# Altium project G4y_SuperCap.PrjPcb
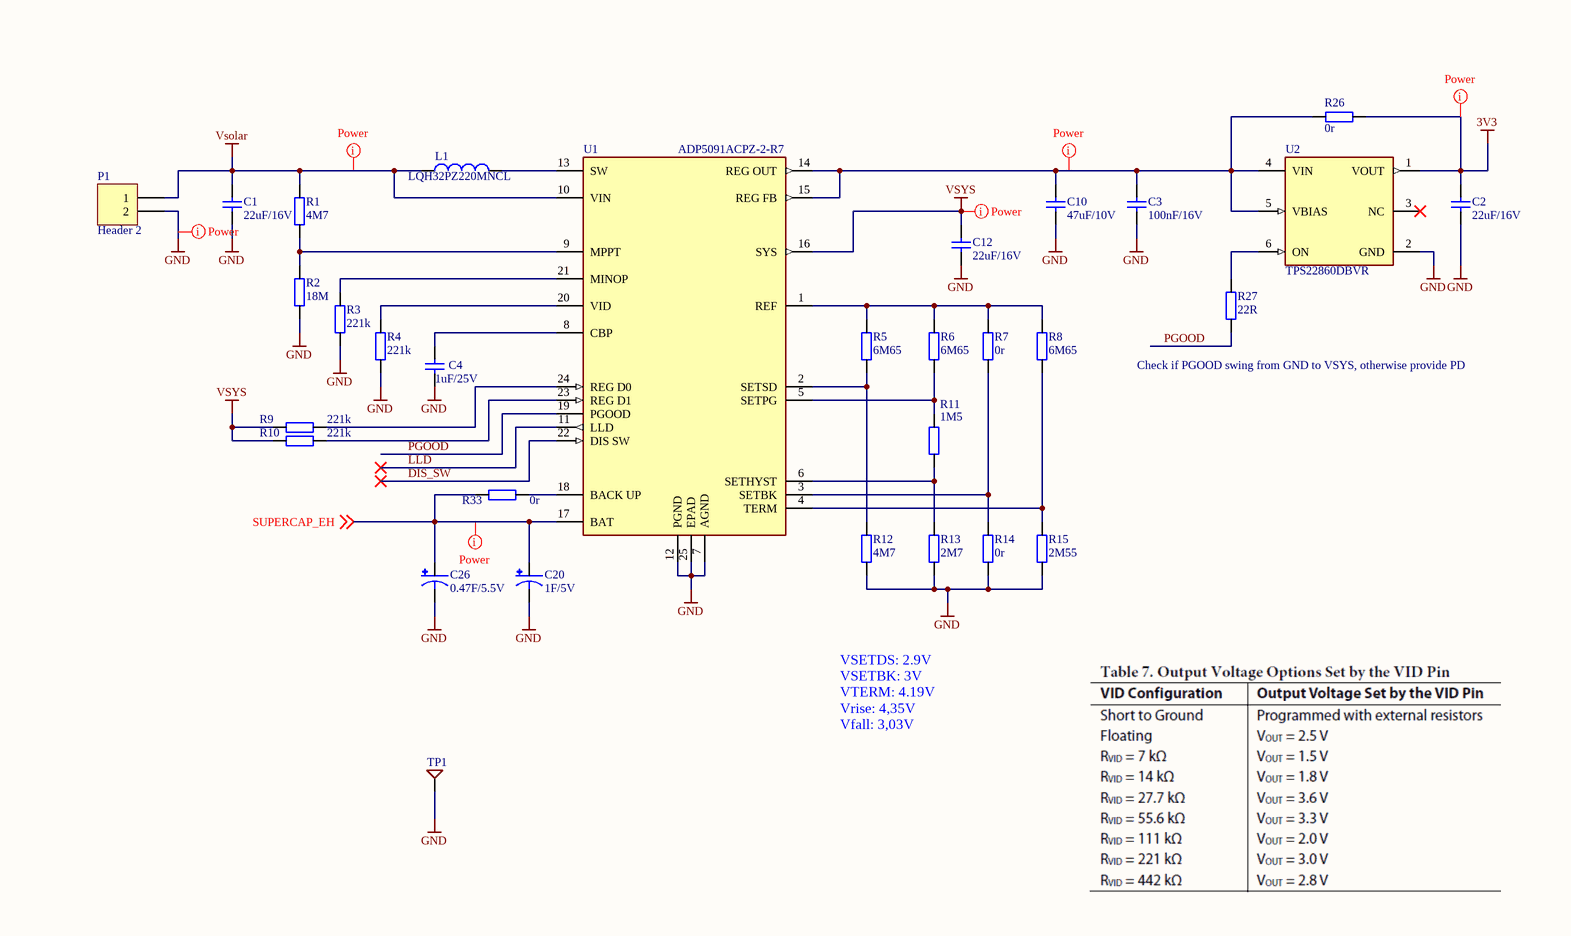
[diagram p0: PowerSupply.SchDoc, right]
3 sheets, 78 parts. Net scope: global (net labels, ports and power ports of the same name join across sheets).
Board file: G4y_SuperCap.PcbDoc
Sheets:
  PowerSupply.SchDoc
  Display.SchDoc
  G4y_SuperCap.SchDoc

## Sheet PowerSupply.SchDoc: PowerSupply
size A4; CheckedBy: D. Actis Grosso; Author: Simone C.; DocumentNumber: 2; Revision: 1.3; SheetNumber: 2; SheetTotal: 3

### Parts
C1  value 22uF/16V  [C0805]  (hidden comment: Cap_0805_22uF/16V)
C2  value 22uF/16V  [C0805]  (hidden comment: Cap_0805_22uF/16V)
C3  value 100nF/16V  [C0402]  (hidden comment: Cap_0402_100n/16V)
C4  value 1uF/25V  [C0402]  (hidden comment: Cap_0402_1uF/25V)
C10  value 47uF/10V  [C1206]  (hidden comment: Cap_1206_47uF/10V)
C12  value 22uF/16V  [C0805]  (hidden comment: Cap_0805_22uF/16V)
C20  value 1F/5V  [DGH105Q5R5]  (hidden comment: SuperCap_1F/5V)
C26  value 0.47F/5.5V  [SUPCAP_D20mm]  (hidden comment: SuperCap_0.47F/5.5V)
L1  Part Number: LQH32PZ220MNCL  [FP-LQH32PB_NC-MFG]  (hidden comment: Inductor_22uH_550mA)
P1  Header 2  [HDR1X2]  (no BOM)
R1  value 4M7  [R0402]  (hidden comment: R_R0402_4M7)
R2  value 18M  [R0402]  (hidden comment: R_R0402_18M)
R3  value 221k  [R0402]  (hidden comment: R_R0402_221k)
R4  value 221k  [R0402]  (hidden comment: R_R0402_221k)
R5  value 6M65  [R0402]  (hidden comment: R_R0402_6M65)
R6  value 6M65  [R0402]  (hidden comment: R_R0402_6M65)
R7  value 0r  [R0402]  (hidden comment: R_R0402_0R)
R8  value 6M65  [R0402]  (hidden comment: R_R0402_6M65)
R9  value 221k  [R0402]  (hidden comment: R_R0402_221k)
R10  value 221k  [R0402]  (hidden comment: R_R0402_221k)
R11  value 1M5  [R0402]  (hidden comment: R_R0402_1M5)
R12  value 4M7  [R0402]  (hidden comment: R_R0402_4M7)
R13  value 2M7  [R0402]  (hidden comment: R_R0402_2M7)
R14  value 0r  [R0402]  (hidden comment: R_R0402_0R)
R15  value 2M55  [R0402]  (hidden comment: R_R0402_2M55)
R26  value 0r  [R0402]  (hidden comment: R_R0402_0R)
R27  value 22R  [R0402]  (hidden comment: R_R0402_22R)
R33  value 0r  [R0402]  (hidden comment: R_R0402_0R)
TP1  TestPoint Trough Hole  [TestP-TH-1.32mm]  (value not drawn)  (no BOM)
U1  ADP5091ACPZ-2-R7  [FP-CP-24-14-IPC_B]
U2  TPS22860DBVR  [SOT-23-6]

### Nets
3V3: C2.1 R26.1 U2.1(VOUT)
GND: C1.2 C2.2 C3.2 C4.2 C10.2 C12.2 C20.- C26.- P1.2 R2.1 R3.1 R4.1 R12.1 R13.1 R14.1 R15.1 TP1.0(TP) U1.7(AGND) U1.12(PGND) U1.25(EPAD) U2.2(GND)
Vsolar: C1.1 L1.1 P1.1 R1.2 U1.10(VIN)
VSYS: C12.1 R9.2 R10.2 U1.16(SYS)
DIS_SW: U1.22(DIS_SW)
LLD: U1.11(LLD)
PGOOD: R27.2 U1.19(PGOOD)
SUPERCAP_EH: C20.+ C26.+ R33.2 U1.17(BAT) ; off-sheet SUPERCAP_EH
NetC3_1: C3.1 C10.1 R26.2 U1.14(REG_OUT) U1.15(REG_FB) U2.4(VIN) U2.5(VBIAS)
NetC4_1: C4.1 U1.8(CBP)
NetL1_2: L1.2 U1.13(SW)
NetR1_1: R1.1 R2.2 U1.9(MPPT)
NetR3_2: R3.2 U1.21(MINOP)
NetR4_2: R4.2 U1.20(VID)
NetR5_1: R5.1 R12.2 U1.2(SETSD)
NetR5_2: R5.2 R6.2 R7.2 R8.2 U1.1(REF)
NetR6_1: R6.1 R11.2 U1.5(SETPG)
NetR7_1: R7.1 R14.2 U1.3(SETBK)
NetR8_1: R8.1 R15.2 U1.4(TERM)
NetR9_1: R9.1 U1.24(REG_D0)
NetR10_1: R10.1 U1.23(REG_D1)
NetR11_1: R11.1 R13.2 U1.6(SETHYST)
NetR27_1: R27.1 U2.6(ON)
NetR33_1: R33.1 U1.18(BACK_UP)

Not connected (* = marked no-connect by the designer): U2 3(NC)*

### Layout directives
net class Power: 3V3, GND, NetC3_1, SUPERCAP_EH, Vsolar, VSYS

### Notes on the sheet
- (near R27) Check if PGOOD swing from GND to VSYS, otherwise provide PD
- VSETDS: 2.9V
  VSETBK: 3V
  VTERM: 4.19V
  Vrise: 4,35V
  Vfall: 3,03V
- Title
- Size:
- A4
- Revision:
- Author:
- CheckedBy:
- Date:
- Time:
- Sheet
- of
- ApprovedBy:

### Library data of the parts
C1 C2 C12 = Cap_0805_22uF/16V: 22uF ±20% 16V Ceramic Capacitor X5R 0805; PartNumber: CL21A226MOQNNNE; Manufacturer: Samsung Electro-Mechanics; Case/Package: 0805; LCSC: C98190; Voltage Rating: 16V; LCSC_Alt_1: C33546008; LCSC_Alt_2: C6119898
C3 = Cap_0402_100n/16V: 16V 100nF X7R ±10% 0402 Multilayer Ceramic Capacitors MLCC - SMD/SMT ROHS; PartNumber: CL05B104KO5NNNC; Manufacturer: Samsung Electro-Mechanics; Case/Package: 0402; LCSC: C1525; Voltage Rating: 16V; LCSC_Alt_1: C22435936; LCSC_Alt_2: C576716
C4 = Cap_0402_1uF/25V: 1uF ±10% 25V Ceramic Capacitor X5R 0402; PartNumber: CL05A105KA5NQNC; Manufacturer: Samsung Electro-Mechanics; Case/Package: 0402; LCSC: C52923; LCSC_Alt_1: C7393852; LCSC_Alt_2: C7472946; Voltage Rating: 25V
C10 = Cap_1206_47uF/10V: 47uF ±20% 10V Ceramic Capacitor X5R 1206; PartNumber: CL31A476MPHNNNE; Manufacturer: Samsung Electro-Mechanics; Case/Package: 1206; LCSC: C96123; Voltage Rating: 10V; LCSC_Alt_1: C7432787; LCSC_Alt_2: C6119971
C20 = SuperCap_1F/5V: DGH Series 5.5 v 1.0 F 17x17x8.5mm LS=12mm Radial Super Capacitor; Manufacturer: CDE Illinois Capacitor; Voltage: 5V; Case/Package: Radial; PartNumber: DGH105Q5R5
C26 = SuperCap_0.47F/5.5V: Super cap D=20mm H=8mm; Voltage: 5.5V
L1 = Inductor_22uH_550mA: 550mA 22uH ±20% 685mΩ 650mA 1210 Fixed Inductors RoHS; Manufacturer: Murata; Saturation Current: 650mA; Package: 1210; LCSC_Alt_1: C53224120; LCSC: C4153652; Value: 22uH; LCSC_Alt_2: C22463994
P1 = Header 2: Header, 2-Pin
R1 R12 = R_R0402_4M7: 4.7MΩ ±1% 62.5mW 0402 Thick Film Resistor; PartNumber: 0402WGF4704TCE; Manufacturer: UNI-ROYAL; LCSC: C474132; Case/Package: 0402; LCSC_Alt_1: C354978; LCSC_Alt_2: C49654986; Tolerance: 1%
R2 = R_R0402_18M: 0402, 1% ,63mW; PartNumber: 0402WGF1805TCE; Manufacturer: UNI-ROYAL; Tolerance: 1; LCSC: C423222; Case/Package: 0402
R3 R4 R9 R10 = R_R0402_221k: 221kΩ ±1% 62.5mW 0402 Thick Film Resistor; PartNumber: 0402WGF2213TCE; Manufacturer: UNI-ROYAL; LCSC: C26998; Case/Package: 0402; LCSC_Alt_1: C2998126; LCSC_Alt_2: C49653699; Tolerance: 1%
R5 R6 R8 = R_R0402_6M65: 6.65MΩ ±1% 62.5mW 0402 Thick Film Resistor; PartNumber: 0402WGF6654TCE; Manufacturer: UNI-ROYAL; LCSC: C620472; Case/Package: 0402; LCSC_Alt_1: C172116; LCSC_Alt_2: C477773; Tolerance: 1%
R7 R14 R26 R33 = R_R0402_0R: 0Ω 62.5mW 50V Thick Film Resistor ±5% 0402 Chip Resistor - Surface Mount ROHS; PartNumber: 0402WGJ0000TCE; Manufacturer: UNI-ROYAL; LCSC: C21376; Case/Package: 0402; LCSC_Alt_1: C106231; LCSC_Alt_2: C2906877; Tolerance: 5%
R11 = R_R0402_1M5: 1.5MΩ ±1% 62.5mW 0402 Thick Film Resistor; PartNumber: 0402WGF1504TCE; Manufacturer: UNI-ROYAL; LCSC: C22276; Case/Package: 0402; LCSC_Alt_1: C49653927; LCSC_Alt_2: C2930014; Tolerance: 1%
R13 = R_R0402_2M7: 2.7MΩ ±1% 62.5mW 0402 Thick Film Resistor; PartNumber: 0402WGF2704TCE; Manufacturer: UNI-ROYAL; LCSC: C270621; Case/Package: 0402; LCSC_Alt_1: C3013160; LCSC_Alt_2: C49653355; Tolerance: 1%
R15 = R_R0402_2M55: 2.55MΩ ±1% 62.5mW 0402 Thick Film Resistor; PartNumber: 0402WGF2554TCE; Manufacturer: UNI-ROYAL; LCSC: C423206; Case/Package: 0402; LCSC_Alt_1: C477654; LCSC_Alt_2: 2612093; Tolerance: 1%
R27 = R_R0402_22R: 22Ω ±1% 62.5mW 0402 Thick Film Resistor; PartNumber: 0402WGF220JTCE; Manufacturer: UNI-ROYAL; LCSC: C25092; Case/Package: 0402; LCSC_Alt_1: C49654869; LCSC_Alt_2: C2929994; Tolerance: 1%
TP1 = TestPoint-TH: PartNumber: RS-200-208
U1 = ADP5091ACPZ-2-R7: -40℃~+125℃ 100mV~3.3V 1A 2V 360nA Charging IC、Protection IC Not supported Supercapacitor、Lithium Battery LFCSP-24(4x4) Battery Management ROHS; Manufacturer: Analog Devices; PartNumber: ADP5091ACPZ-2-R7; Case/Package: LFCSP-24(4x4); LCSC: C579259
U2 = TPS22860DBVR: Ultra-Low Leakage Current Single-Channel Load Switch; Manufacturer: Texas Instruments; PartNumber: TPS22860DBVR; LCSC: C132005; Package: SOT-23-6

## Sheet Display.SchDoc: Displays
size A4; CheckedBy: D. Actis Grosso; Author: Simone C.; DocumentNumber: 3; Revision: 1.3; SheetNumber: 3; SheetTotal: 3
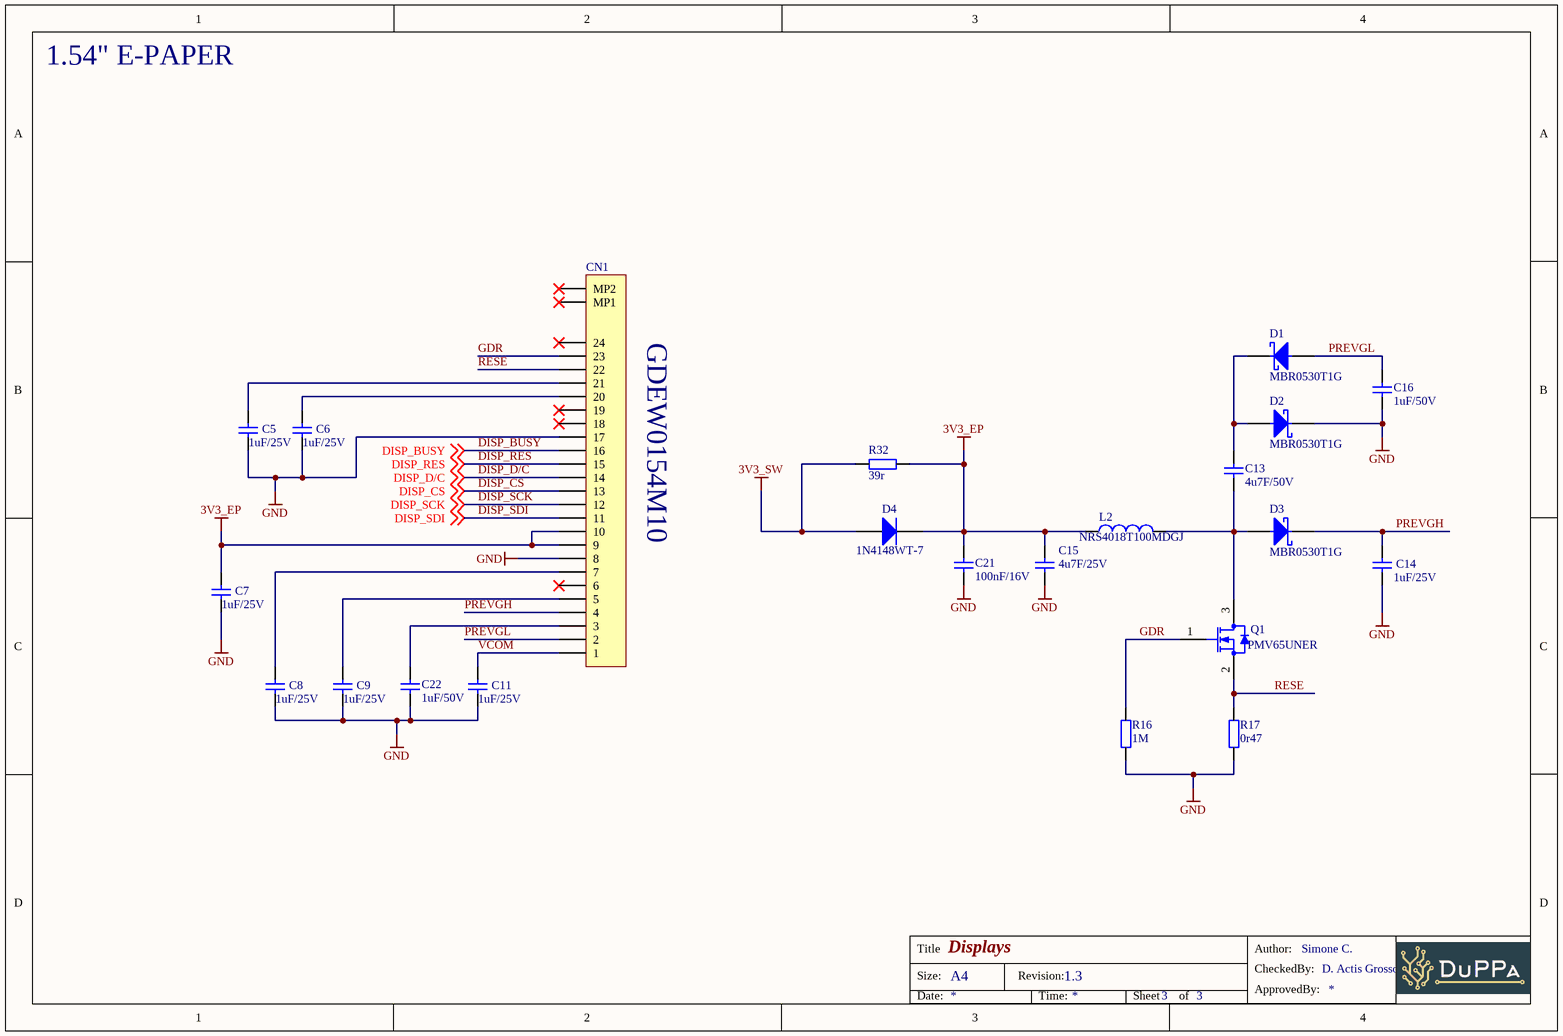
[diagram p1: Display.SchDoc]

### Parts
C5  value 1uF/25V  [C0402]  (hidden comment: Cap_0402_1uF/25V)
C6  value 1uF/25V  [C0402]  (hidden comment: Cap_0402_1uF/25V)
C7  value 1uF/25V  [C0402]  (hidden comment: Cap_0402_1uF/25V)
C8  value 1uF/25V  [C0402]  (hidden comment: Cap_0402_1uF/25V)
C9  value 1uF/25V  [C0402]  (hidden comment: Cap_0402_1uF/25V)
C11  value 1uF/25V  [C0402]  (hidden comment: Cap_0402_1uF/25V)
C13  value 4u7F/50V  [C0805]  (hidden comment: Cap_0805_4u7F/50V)
C14  value 1uF/25V  [C0402]  (hidden comment: Cap_0402_1uF/25V)
C15  value 4u7F/25V  [C0603]  (hidden comment: Cap_0603_4u7F/35V)
C16  value 1uF/50V  [C0603]  (hidden comment: Cap_0603_1uF/50V)
C21  value 100nF/16V  [C0402]  (hidden comment: Cap_0402_100n/16V)
C22  value 1uF/50V  [C0603]  (hidden comment: Cap_0603_1uF/50V)
CN1  F3311A7H121024E200  [F3311A7H121024E200]  (value not drawn)
D1  MBR0530T1G  [FP-SOD123-MFG]
D2  MBR0530T1G  [FP-SOD123-MFG]
D3  MBR0530T1G  [FP-SOD123-MFG]
D4  PartNumber: 1N4148WT-7  [SODFL160X65-2N]  (hidden comment: Diode_1N4148WT)
L2  Part Number: NRS4018T100MDGJ  [FP-NRS4018-MFG]  (hidden comment: 10uH_1.44A_NRS4018T100MDGJ)
Q1  PMV65UNER  [SOT-23-3]
R16  value 1M  [R0402]  (hidden comment: R_R0402_1M)
R17  value 0r47  [R0402]  (hidden comment: R_R0402_0r47)
R32  value 39r  [R0402]  (hidden comment: R_R0402_39r)

### Nets
3V3_EP: C7.1 C15.1 C21.1 CN1.9 CN1.10 D4.K L2.1 R32.2
3V3_SW: D4.A R32.1
GND: C5.2 C6.2 C7.2 C8.2 C9.2 C11.2 C14.2 C15.2 C16.2 C21.2 C22.2 CN1.8 CN1.17 D2.K R16.1 R17.1
DISP_BUSY: CN1.16 ; off-sheet DISP_BUSY
DISP_CS: CN1.13 ; off-sheet DISP_CS
DISP_D/C: CN1.14 ; off-sheet DISP_D/C
DISP_RES: CN1.15 ; off-sheet DISP_RES
DISP_SCK: CN1.12 ; off-sheet DISP_SCK
DISP_SDI: CN1.11 ; off-sheet DISP_SDI
GDR: CN1.23 Q1.1(G) R16.2
PREVGH: C14.1 CN1.4 D3.K
PREVGL: C16.1 CN1.2 D1.A
RESE: CN1.22 Q1.2(S) R17.2
VCOM: C11.1 CN1.1
NetC5_1: C5.1 CN1.21
NetC6_1: C6.1 CN1.20
NetC8_1: C8.1 CN1.7
NetC9_1: C9.1 CN1.5
NetC13_1: C13.1 D1.K D2.A
NetC13_2: C13.2 D3.A L2.2 Q1.3(D)
NetC22_1: C22.1 CN1.3

Not connected (* = marked no-connect by the designer): CN1 6* 18* 19* 24* MP1* MP2*

### Notes on the sheet
- 1.54" E-PAPER
- GDEW0154M10
- Title
- Size:
- A4
- Revision:
- Author:
- CheckedBy:
- Date:
- Time:
- Sheet
- of
- ApprovedBy:

### Library data of the parts
C5-C9 C11 C14 = Cap_0402_1uF/25V: as C4 on sheet PowerSupply; Case/Package: 0402; LCSC: C52923; LCSC_Alt_1: C7393852; LCSC_Alt_2: C7472946; Voltage Rating: 25V
C13 = Cap_0805_4u7F/50V: 4.7uF ±10% 50V Ceramic Capacitor X5R 0805; PartNumber: HGC0805R5475K500NSLJ; Case/Package: 0805; LCSC: C7472969; Voltage Rating: 50V; LCSC_Alt_1: C513770; LCSC_Alt_2: C2903668
C15 = Cap_0603_4u7F/35V: 4.7uF ±10% 35V Ceramic Capacitor X5R 0603; PartNumber: CL10A475KL8NRNC; Manufacturer: Samsung Electro-Mechanics; Case/Package: 0603; LCSC: C307467; Voltage Rating: 35V; LCSC_Alt_1: C6119851; LCSC_Alt_2: C22367829
C16 C22 = Cap_0603_1uF/50V: 50V 1uF X5R ±10% 0603 Ceramic Capacitors ROHS; PartNumber: CL10A105KB8NNNC; Manufacturer: Samsung Electro-Mechanics; Case/Package: 0603; LCSC: C15849; Voltage Rating: 50V; LCSC_Alt_1: C6119852; LCSC_Alt_2: C380313
C21 = Cap_0402_100n/16V: as C3 on sheet PowerSupply; Case/Package: 0402; LCSC: C1525; Voltage Rating: 16V; LCSC_Alt_1: C22435936; LCSC_Alt_2: C576716
CN1 = F3311A7H121024E200: FFC/FPC Connector 24 Position 0.5mm Pitch Double-Sided Contacts, Top and Bottom Entry Surface Mount, Right Angle -55℃~+85℃; Manufacturer: Amphenol ICC / FCI; Number of Contacts: 24P; LCSC_Alt_1: C52722656; LCSC_Alt_2: C48678015; LCSC: C3168055; Mount: SMD; Number of Positions: 24P; Number of Rows: 1; Orientation: Righht; PartNumber: F3311A7H121024E200; Pitch: 0.5mm
D1-D3 = MBR0530T1G: Diode 30V 500mA Surface Mount SOD-123; Manufacturer: Onsemi; PartNumber: MBR0530T1G; Package: SOD-123; LCSC: C82046; LCSC_Alt_1: C5204746; LCSC_Alt_2: C236079
D4 = Diode_1N4148WT: Diode Independent 80V 125mA Surface Mount SOD-523; Manufacturer: Diodes; Category: Rectifier Diodes; Case/Package: SOD-523; LCSC_Alt_1: C727112; LCSC_Alt_2: C5381437; LCSC: C83482
L2 = 10uH_1.44A_NRS4018T100MDGJ: 1.2A 10uH ±20% 1.3A 150mΩ SMD,4x4mm Fixed Inductors RoHS; Manufacturer: Taiyo Yuden; Saturation Current: 1.3A; Package: 4018; LCSC_Alt_1: C2041931; LCSC: C222882; Value: 10uH
Q1 = PMV65UNER: N-Channel 20V 2.8A 940mW Surface Mount SOT-23; Manufacturer: Nexperia; Category: MOSFETs; PartNumber: PMV65UNER; LCSC: C179446
R16 = R_R0402_1M: 1MΩ ±1% 62.5mW 0402 Thick Film Resistor; PartNumber: 0402WGF1004TCE; Manufacturer: UNI-ROYAL; LCSC: C26083; Case/Package: 0402; LCSC_Alt_1: C2909328; LCSC_Alt_2: C2770623; Tolerance: 1%
R17 = R_R0402_0r47: 0402, 1% ,63mW; PartNumber: RL0402JR-070R47L; LCSC: C423162; Case/Package: 0402
R32 = R_R0402_39R: 39Ω ±1% 62.5mW 0402 Thick Film Resistor; PartNumber: 0402WGF390JTCE; Manufacturer: UNI-ROYAL; LCSC: C25110; Case/Package: 0402; LCSC_Alt_1: C2770700; LCSC_Alt_2: C2909354; Tolerance: 1%

## Sheet G4y_SuperCap.SchDoc: Arduino and NFC
size A4; CheckedBy: D. Actis Grosso; Author: Simone C.; DocumentNumber: 1; Revision: 1.3; SheetNumber: 1; SheetTotal: 3
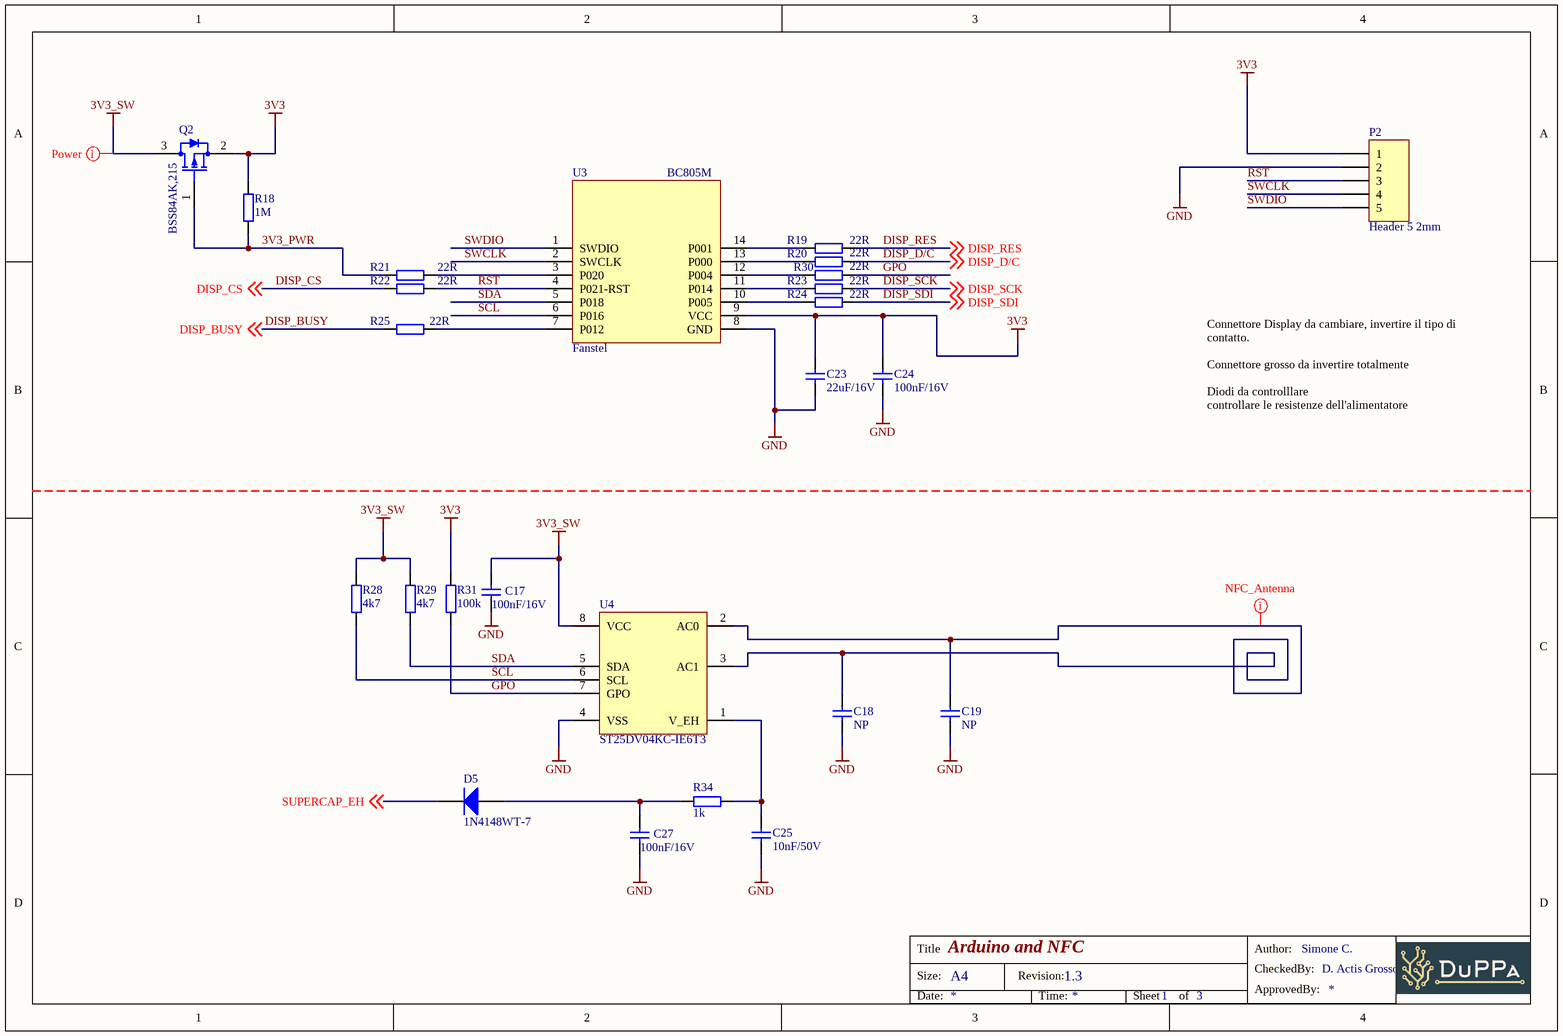
[diagram p2: G4y_SuperCap.SchDoc]

### Parts
C17  value 100nF/16V  [C0402]  (hidden comment: Cap_0402_100n/16V)
C18  value NP  [C0402]  (hidden comment: Cap_0402_NP)  (no BOM)
C19  value NP  [C0402]  (hidden comment: Cap_0402_NP)  (no BOM)
C23  value 22uF/16V  [C0805]  (hidden comment: Cap_0805_22uF/16V)
C24  value 100nF/16V  [C0402]  (hidden comment: Cap_0402_100n/16V)
C25  value 10nF/50V  [C0402]  (hidden comment: Cap_0402_10nF/50V)
C27  value 100nF/16V  [C0402]  (hidden comment: Cap_0402_100n/16V)
D5  PartNumber: 1N4148WT-7  [SODFL160X65-2N]  (hidden comment: Diode_1N4148WT)
P2  Header 5 2mm  [HDR1X5_2mm]  (no BOM)
Q2  PartNumber: BSS84AK,215  [SOT-23-3]  (hidden comment: BSS84AKBSS84AK,215)
R18  value 1M  [R0402]  (hidden comment: R_R0402_1M)
R19  value 22R  [R0402]  (hidden comment: R_R0402_22R)
R20  value 22R  [R0402]  (hidden comment: R_R0402_22R)
R21  value 22R  [R0402]  (hidden comment: R_R0402_22R)
R22  value 22R  [R0402]  (hidden comment: R_R0402_22R)
R23  value 22R  [R0402]  (hidden comment: R_R0402_22R)
R24  value 22R  [R0402]  (hidden comment: R_R0402_22R)
R25  value 22R  [R0402]  (hidden comment: R_R0402_22R)
R28  value 4k7  [R0402]  (hidden comment: R_R0402_4k7)
R29  value 4k7  [R0402]  (hidden comment: R_R0402_4k7)
R30  value 22R  [R0402]  (hidden comment: R_R0402_22R)
R31  value 100k  [R0402]  (hidden comment: R_R0402_100k)
R34  value 1k  [R0402]  (hidden comment: R_R0402_1k)
U3  Manufacturer: Fanstel  [BC805M]  (hidden comment: BLE Module)
U4  ST25DV04KC-IE6T3  [TSOP65P640X120-8N]

### Nets
3V3: C23.1 C24.1 P2.1 Q2.2(S) R18.2 R31.2 U3.9(VCC)
3V3_SW: C17.1 Q2.3(D) R28.1 R29.1 U4.8(VCC)
GND: C17.2 C18.2 C19.2 C23.2 C24.2 C25.2 C27.2 P2.2 U3.8(GND) U4.4(VSS)
3V3_PWR: Q2.1(G) R18.1 R21.1
DISP_BUSY: R25.1 ; off-sheet DISP_BUSY
DISP_CS: R22.1 ; off-sheet DISP_CS
DISP_D/C: R20.1 ; off-sheet DISP_D/C
DISP_RES: R19.1 ; off-sheet DISP_RES
DISP_SCK: R23.1 ; off-sheet DISP_SCK
DISP_SDI: R24.1 ; off-sheet DISP_SDI
GPO: R30.1 R31.1 U4.7(GPO)
RST: P2.3 R22.2 U3.4(P021-RST)
SCL: R28.2 U3.6(P016) U4.6(SCL)
SDA: R29.2 U3.5(P018) U4.5(SDA)
SUPERCAP_EH: D5.K ; off-sheet SUPERCAP_EH
SWCLK: P2.4 U3.2(SWCLK)
SWDIO: P2.5 U3.1(SWDIO)
NetC18_1: C18.1 C19.1 U4.2(AC0) U4.3(AC1)
NetC25_1: C25.1 R34.2 U4.1(V_EH)
NetC27_1: C27.1 D5.A R34.1
NetR19_2: R19.2 U3.14(P001)
NetR20_2: R20.2 U3.13(P000)
NetR21_2: R21.2 U3.3(P020)
NetR23_2: R23.2 U3.11(P014)
NetR24_2: R24.2 U3.10(P005)
NetR25_2: R25.2 U3.7(P012)
NetR30_2: R30.2 U3.12(P004)

### Layout directives
net class NFC_Antenna: NetC18_1
net class Power: 3V3_SW

### Notes on the sheet
- Connettore Display da cambiare, invertire il tipo di contatto.
  Connettore grosso da invertire totalmente
  Diodi da controlllare
  controllare le resistenze dell'alimentatore
- Title
- Size:
- A4
- Revision:
- Author:
- CheckedBy:
- Date:
- Time:
- Sheet
- of
- ApprovedBy:

### Library data of the parts
C17 C24 C27 = Cap_0402_100n/16V: as C3 on sheet PowerSupply; Case/Package: 0402; LCSC: C1525; Voltage Rating: 16V; LCSC_Alt_1: C22435936; LCSC_Alt_2: C576716
C23 = Cap_0805_22uF/16V: as C1 on sheet PowerSupply; Case/Package: 0805; LCSC: C98190; Voltage Rating: 16V; LCSC_Alt_1: C33546008; LCSC_Alt_2: C6119898
C25 = Cap_0402_10nF/50V: 10nF ±10% 50V Ceramic Capacitor X7R 0402; PartNumber: CL05B103KB5NNNC; Manufacturer: Samsung Electro-Mechanics; Case/Package: 0402; LCSC: C15195; LCSC_Alt_1: C6119808; LCSC_Alt_2: C5137480; Voltage Rating: 50V
D5 = Diode_1N4148WT: as D4 on sheet Display; Category: Rectifier Diodes; Case/Package: SOD-523; LCSC_Alt_1: C727112; LCSC_Alt_2: C5381437; LCSC: C83482
P2 = Header 5 2mm: Header, 5-Pin
Q2 = BSS84AKBSS84AK,215: P-Channel 50V 180mA 420mW Surface Mount SOT-23; Manufacturer: Nexperia; Category: MOSFETs; LCSC_Alt_1: C549760; LCSC_Alt_2: C7379993; LCSC: C127273
R18 = R_R0402_1M: as R16 on sheet Display; LCSC: C26083; Case/Package: 0402; LCSC_Alt_1: C2909328; LCSC_Alt_2: C2770623; Tolerance: 1%
R19-R25 R30 = R_R0402_22R: as R27 on sheet PowerSupply; LCSC: C25092; Case/Package: 0402; LCSC_Alt_1: C49654869; LCSC_Alt_2: C2929994; Tolerance: 1%
R28 R29 = R_R0402_4k7: 0402, 1% ,63mW; PartNumber: 0402WGF4701TCE; LCSC: C25900; Case/Package: 0402
R31 = R_R0402_100k: 0402, 1% ,63mW; PartNumber: ERA-2VEB1003X; LCSC: C25741; Case/Package: 0402
R34 = R_R0402_1k: 0402, 1% ,63mW; PartNumber: 0402WGJ0102TCE; Manufacturer: UNI-ROYAL; LCSC: C25543; Case/Package: 0402; Tolerance: 1%
U3 = BC805M: Bluetooth Modules - 802.15.1 Bluetooth Low Energy, BLE 5.2 Module using Nordic nRF52805 SoC with integrated antenna; LCSC: C6751361; PartNumber: BC805M
U4 = ST25DV04KC-IE6T3: 53Kbit/s ISO 15693,NFC I2C TSSOP-8 RFID, RF Access, Monitoring ICs RoHS; Manufacturer: STMicroelectronics; Organization: 512X8; Case/Package: TSSOP; PartNumber: ST25DV04KC-IE6T3; LCSC_Alt_1: C5267455; LCSC: C5221719
C18 C19 = Cap_0402_NP: Case/Package: 0402

## Nets that join several sheets
3V3: PowerSupply (C2.1 R26.1 U2.1), G4y_SuperCap (7 pins)
3V3_SW: Display (D4.A R32.1), G4y_SuperCap (5 pins)
GND: PowerSupply (21 pins), Display (16 pins), G4y_SuperCap (10 pins)
DISP_BUSY: Display (CN1.16), G4y_SuperCap (R25.1)
DISP_CS: Display (CN1.13), G4y_SuperCap (R22.1)
DISP_D/C: Display (CN1.14), G4y_SuperCap (R20.1)
DISP_RES: Display (CN1.15), G4y_SuperCap (R19.1)
DISP_SCK: Display (CN1.12), G4y_SuperCap (R23.1)
DISP_SDI: Display (CN1.11), G4y_SuperCap (R24.1)
SUPERCAP_EH: PowerSupply (C20.+ C26.+ R33.2 U1.17), G4y_SuperCap (D5.K)

## Assembly variants
Production_PG_Enable_noDisplay: not fitted C5 C6 C7 C8 C9 C11 C13 C14 C15 C16 C18 C19 C20 C21 C22 C26 CN1 D1 D2 D3 D4 L2 Q1 R7 R16 R17 R19 R20 R22 R23 R24 R25 R26 R32
Production_PG_Enable: not fitted C18 C19 C20 C26 D4 R7 R26